# EAGLE design 304_usb_serial020001 (EAGLE 9.6.2)
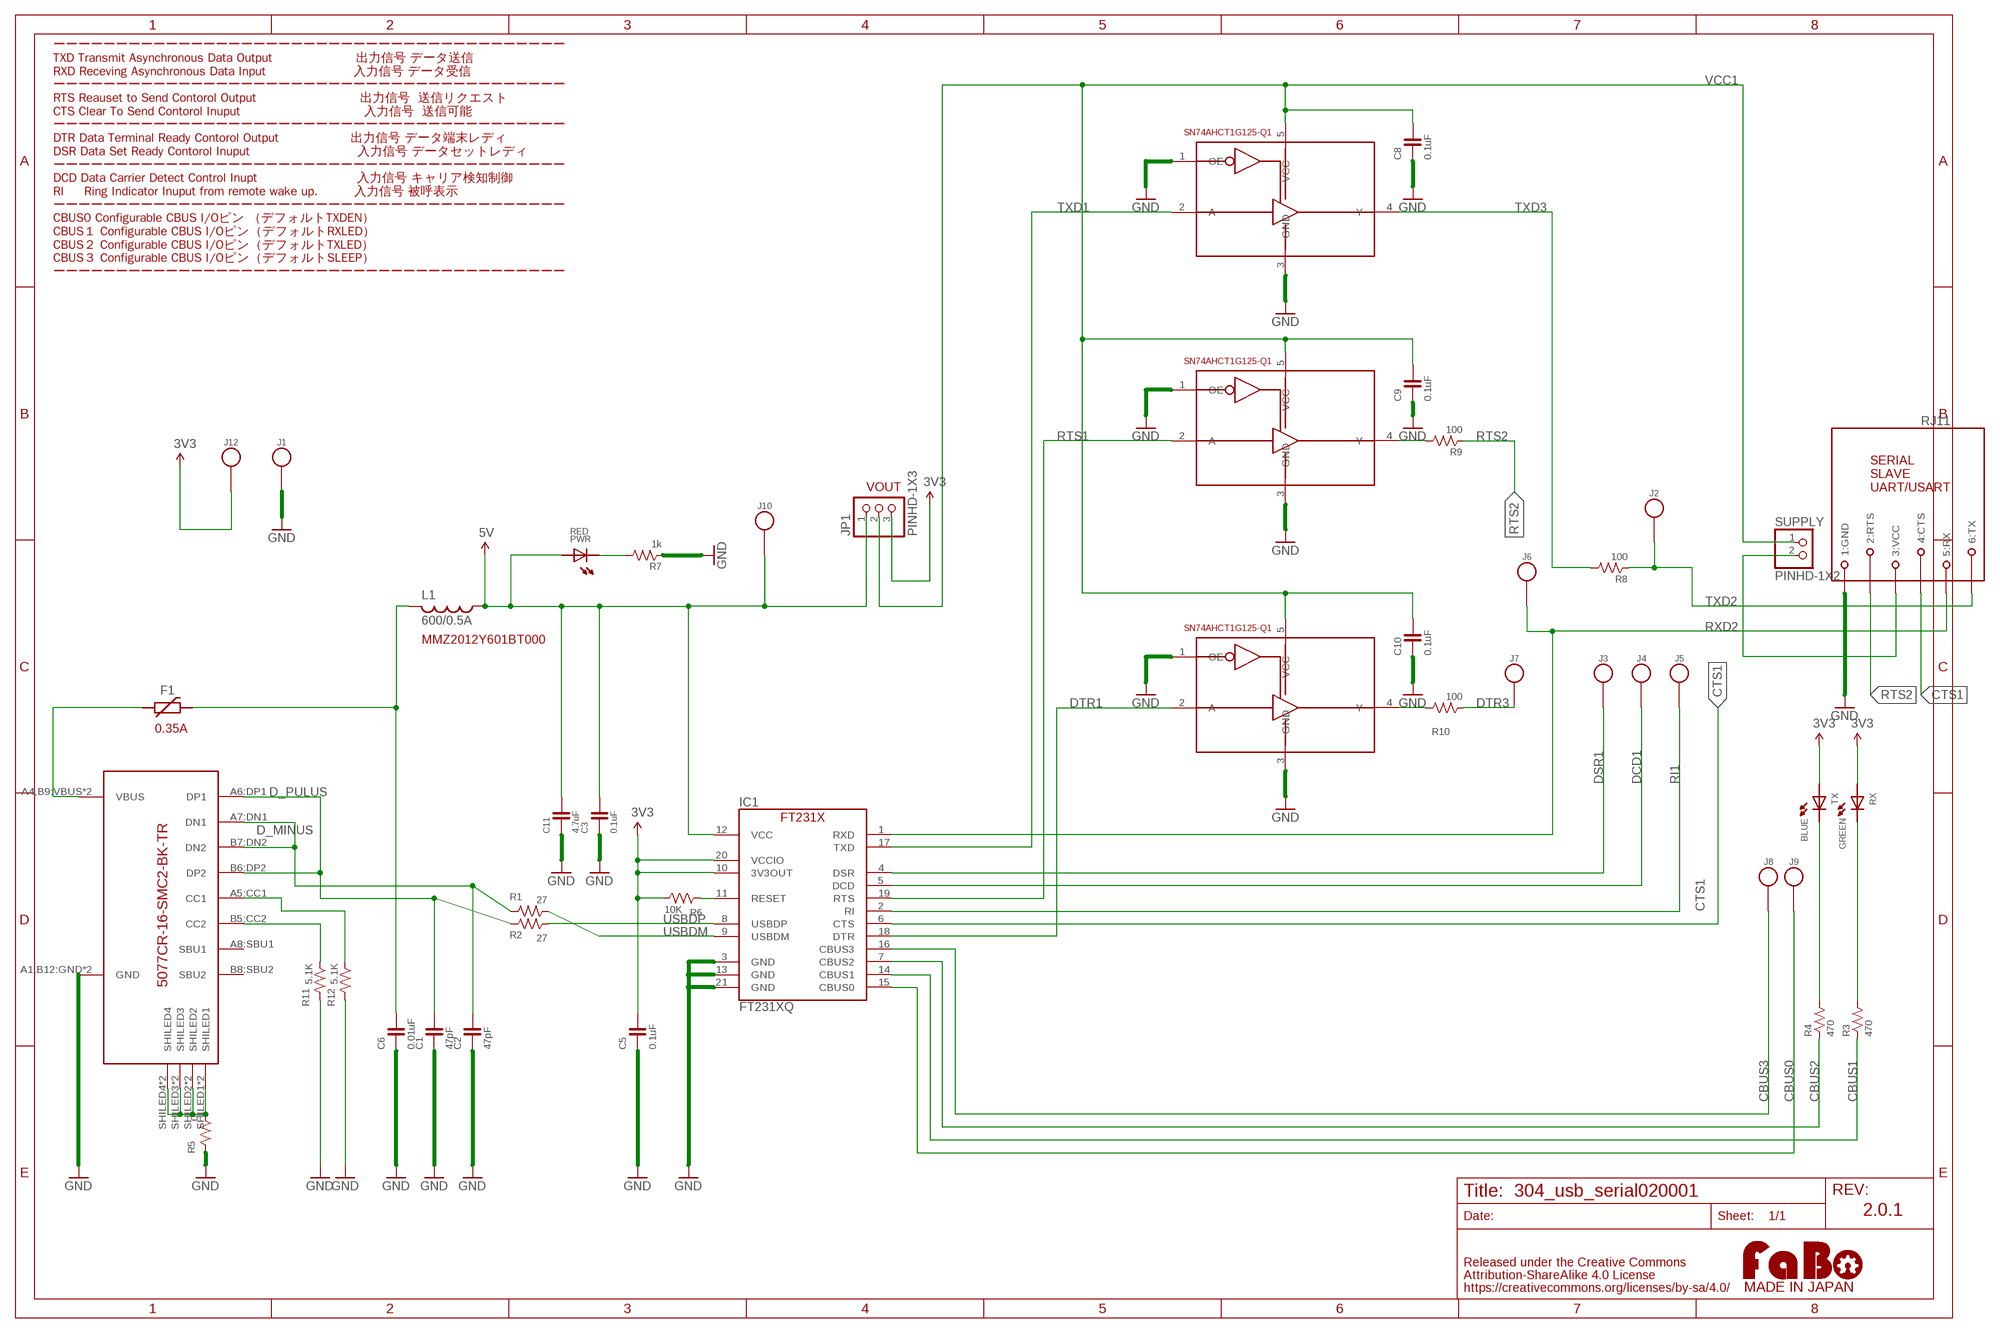
[diagram p0: schematic, sheet 1]

## Parts
C1  47pF  CAPACITOR-0402  [0402]
C2  47pF  CAPACITOR-0402  [0402]
C3  0.1uF  CAPACITOR-0402  [0402]
C5  0.1uF  CAPACITOR-0402  [0402]
C6  0.01uF  CAPACITOR-0402  [0402]
C8  0.1uF  CAPACITOR-0402  [0402]
C9  0.1uF  CAPACITOR-0402  [0402]
C10  0.1uF  CAPACITOR-0402  [0402]
C11  4.7uF  CAPACITOR-0402  [0402]
F1  350mA  POLYSWITCH  [NANOSMDC035F]
IC1  FT231XQ  [QFN-20_FT231X]
J1  PIN_HEADER_1X1_NOLABEL_C  [PIN_1X1_NOLABEL]
J2  PIN_HEADER_1X1_NOLABEL_C  [PIN_1X1_NOLABEL]
J3  PIN_HEADER_1X1_NOLABEL_C  [PIN_1X1_NOLABEL]
J4  PIN_HEADER_1X1_NOLABEL_C  [PIN_1X1_NOLABEL]
J5  PIN_HEADER_1X1_NOLABEL_C  [PIN_1X1_NOLABEL]
J6  PIN_HEADER_1X1_NOLABEL_C  [PIN_1X1_NOLABEL]
J7  PIN_HEADER_1X1_NOLABEL_C  [PIN_1X1_NOLABEL]
J8  PIN_HEADER_1X1_NOLABEL_C  [PIN_1X1_NOLABEL]
J9  PIN_HEADER_1X1_NOLABEL_C  [PIN_1X1_NOLABEL]
J10  PIN_HEADER_1X1_NOLABEL_C  [PIN_1X1_NOLABEL]
J12  PIN_HEADER_1X1_NOLABEL_C  [PIN_1X1_NOLABEL]
JP1  PINHD-1X3  [1X03]
L1  600/0.5A  INDUCTOR_0805_L  [RESC0805_L]
PWR  RED  LED-0603-NARROW  [0603-NARROW]
R1  27  RESISTOR-0603-NARROW  [0603-NARROW]
R2  27  RESISTOR-0603-NARROW  [0603-NARROW]
R3  470  RESISTOR-0603-NARROW  [0603-NARROW]
R4  470  RESISTOR-0603-NARROW  [0603-NARROW]
R5  0  RESISTOR-0603-NARROW  [0603-NARROW]
R6  10K  RESISTOR-0603-NARROW  [0603-NARROW]
R7  1k  RESISTOR-0603-NARROW  [0603-NARROW]
R8  100  RESISTOR-0603-NARROW  [0603-NARROW]
R9  100  RESISTOR-0603-NARROW  [0603-NARROW]
R10  100  RESISTOR-0603-NARROW  [0603-NARROW]
R11  5.1K  RESISTOR-0603-NARROW  [0603-NARROW]
R12  5.1K  RESISTOR-0603-NARROW  [0603-NARROW]
RJ11  MODULAR-JACK-6P-RJ11_SERIAL_S_USART  [7002-6PXC-X]
RX  GREEN  LED-0603-NARROW  [0603-NARROW]
SUPPLY  PINHD-1X2  [1X02]
TX  BLUE  LED-0603-NARROW  [0603-NARROW]
U$2  LOGO_FABO-M_BOTTOM  [LOGO_FABO_MS_BOTTOM]
U$4  5077CR-16-SMC2-BK-TR  [5077CR-16-SMC2-BK-TR]
U$6  SN74AHCT1G125-Q1  [SC70]
U$7  SN74AHCT1G125-Q1  [SC70]
U$8  SN74AHCT1G125-Q1  [SC70]

## Nets
3V3: C5.2 IC1.10(3V3OUT) IC1.20(VCCIO) J12.1 JP1.3 R6.1 RX.ANODE TX.ANODE
5V: C3.2 C11.2 IC1.12(VCC) J10.1 JP1.1 L1.1 PWR.ANODE
CBUS0: IC1.15(CBUS0) J9.1
CBUS1: IC1.14(CBUS1) R3.1
CBUS2: IC1.7(CBUS2) R4.1
CBUS3: IC1.16(CBUS3) J8.1
CTS1: IC1.6(CTS) RJ11.4(4:CTS)
D_MINUS: C2.2 R1.2 U$4.A7:DN1(DN1) U$4.B7:DN2(DN2)
D_PULUS: C1.2 R2.2 U$4.A6:DP1(DP1) U$4.B6:DP2(DP2)
DCD1: IC1.5(DCD) J4.1
DSR1: IC1.4(DSR) J3.1
DTR1: IC1.18(DTR) U$8.2(A)
DTR3: J7.1 R10.1
GND: C1.1 C2.1 C3.1 C5.1 C6.1 C8.1 C9.1 C10.1 C11.1 IC1.3(GND) IC1.13(GND) IC1.21(GND) J1.1 R5.2 R7.1 R11.2 R12.2 RJ11.1(1:GND) U$4.A1,B12:GND(GND) U$4.B1,A12:GND(GND) U$6.1(OE) U$6.3(GND) U$7.1(OE) U$7.3(GND) U$8.1(OE) U$8.3(GND)
N$1: R9.2 U$7.4(Y)
N$2: C6.2 F1.2 L1.2
N$3: R11.1 U$4.B5:CC2(CC2)
N$4: R12.1 U$4.A5:CC1(CC1)
N$5: PWR.CATHODE R7.2
N$8: R10.2 U$8.4(Y)
N$15: IC1.11(RESET) R6.2
N$33: R3.2 RX.CATHODE
N$35: R4.2 TX.CATHODE
RI1: IC1.2(RI) J5.1
RTS1: IC1.19(RTS) U$7.2(A)
RTS2: R9.1 RJ11.2(2:RTS)
RXD2: IC1.1(RXD) J6.1 RJ11.5(5:RX)
SHILED: R5.1 U$4.SHILED1 U$4.SHILED2 U$4.SHILED3 U$4.SHILED4 U$4.SHILED5(SHILED1) U$4.SHILED6(SHILED2) U$4.SHILED7(SHILED3) U$4.SHILED8(SHILED4)
TXD1: IC1.17(TXD) U$6.2(A)
TXD2: J2.1 R8.1 RJ11.6(6:TX)
TXD3: R8.2 U$6.4(Y)
USBDM: IC1.9(USBDM) R1.1
USBDP: IC1.8(USBDP) R2.1
VBUS: F1.1 U$4.A4,B9:VBUS(VBUS) U$4.B4,A9:VBUS(VBUS)
VCC1: C8.2 C9.2 C10.2 JP1.2 SUPPLY.1 U$6.5(VCC) U$7.5(VCC) U$8.5(VCC)
VCC2: RJ11.3(3:VCC) SUPPLY.2
Unconnected: U$4.A8:SBU1(SBU1) U$4.B8:SBU2(SBU2)

## Notes on the sheet
- ーーーーーーーーーーーーーーーーーーーーーーーーーーーーーーーーーーーーーーーーー
  TXD Transmit Asynchronous Data Output                     出力信号 データ送信
  RXD Receving Asynchronous Data Input                      入力信号 データ受信
  ーーーーーーーーーーーーーーーーーーーーーーーーーーーーーーーーーーーーーーーーー
  RTS Reauset to Send Contorol Output                          出力信号  送信リクエスト
  CTS Clear To Send Contorol Inuput                               入力信号  送信可能 
  ーーーーーーーーーーーーーーーーーーーーーーーーーーーーーーーーーーーーーーーーー
  DTR Data Terminal Ready Contorol Output                  出力信号 データ端末レディ
  DSR Data Set Ready Contorol Inuput                           入力信号 データセットレディ
  ーーーーーーーーーーーーーーーーーーーーーーーーーーーーーーーーーーーーーーーーー
  DCD Data Carrier Detect Control Inupt                         入力信号 キャリア検知制御
  RI     Ring Indicator Inuput from remote wake up.         入力信号 被呼表示
  ーーーーーーーーーーーーーーーーーーーーーーーーーーーーーーーーーーーーーーーーー
  CBUS0 Configurable CBUS I/Oピン （デフォルトTXDEN）
  CBUS１ Configurable CBUS I/Oピン（デフォルトRXLED）
  CBUS２ Configurable CBUS I/Oピン（デフォルトTXLED）
  CBUS３ Configurable CBUS I/Oピン（デフォルトSLEEP）
  ーーーーーーーーーーーーーーーーーーーーーーーーーーーーーーーーーーーーーーーーー
- VOUT
- MMZ2012Y601BT000
- 0.35A
- 2.0.1

## Library data of the parts
C1-C3 C5 C6 C8-C11 = FaBo-Capacitor:CAPACITOR: CAPACITOR
F1 = FaBo-Parts:POLYSWITCH
IC1 = FaBo-USB:FT231X
J1-J10 J12 = FaBo-PIN:PIN_HEADER_1X1_NOLABEL_C
JP1 = Connector:PINHD-1X3: PIN HEADER; CATEGORY: CONNECTOR; SUB-CATEGORY: PIN-HEADER
L1 = Nordic_nRF:INDUCTOR: Generic chip inductor
PWR RX TX = FaBo-LED:LED
R1-R12 = FaBo-Resistors:RESISTOR: RESISTOR
RJ11 = FaBo-Connetor:MODULAR-JACK-6P-RJ11_SERIAL_S_USART
SUPPLY = Connector:PINHD-1X2: PIN HEADER; CATEGORY: CONNECTOR; SUB-CATEGORY: PIN-HEADER
U$2 = FaBo-Logo:LOGO_FABO
U$4 = FaBo-USB:5077CR-16-SMC2-BK-TR
U$6-U$8 = FaBo-LevelTranslator:SN74AHCT1G125-Q1: SN74AHCT1G125-Q1 SINGLE BUFFER GATE WITH 3 STATE OUTPUT

## Board
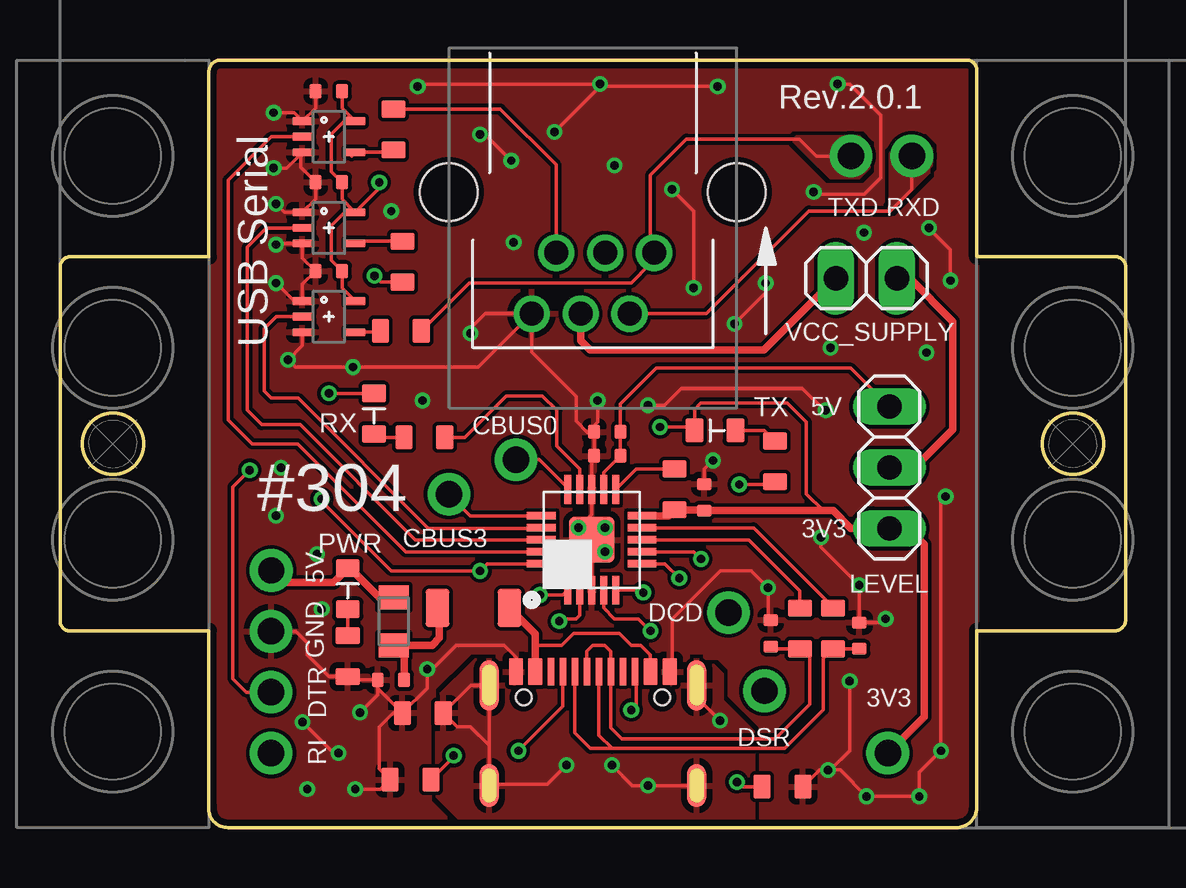
[diagram p1: board, top side]
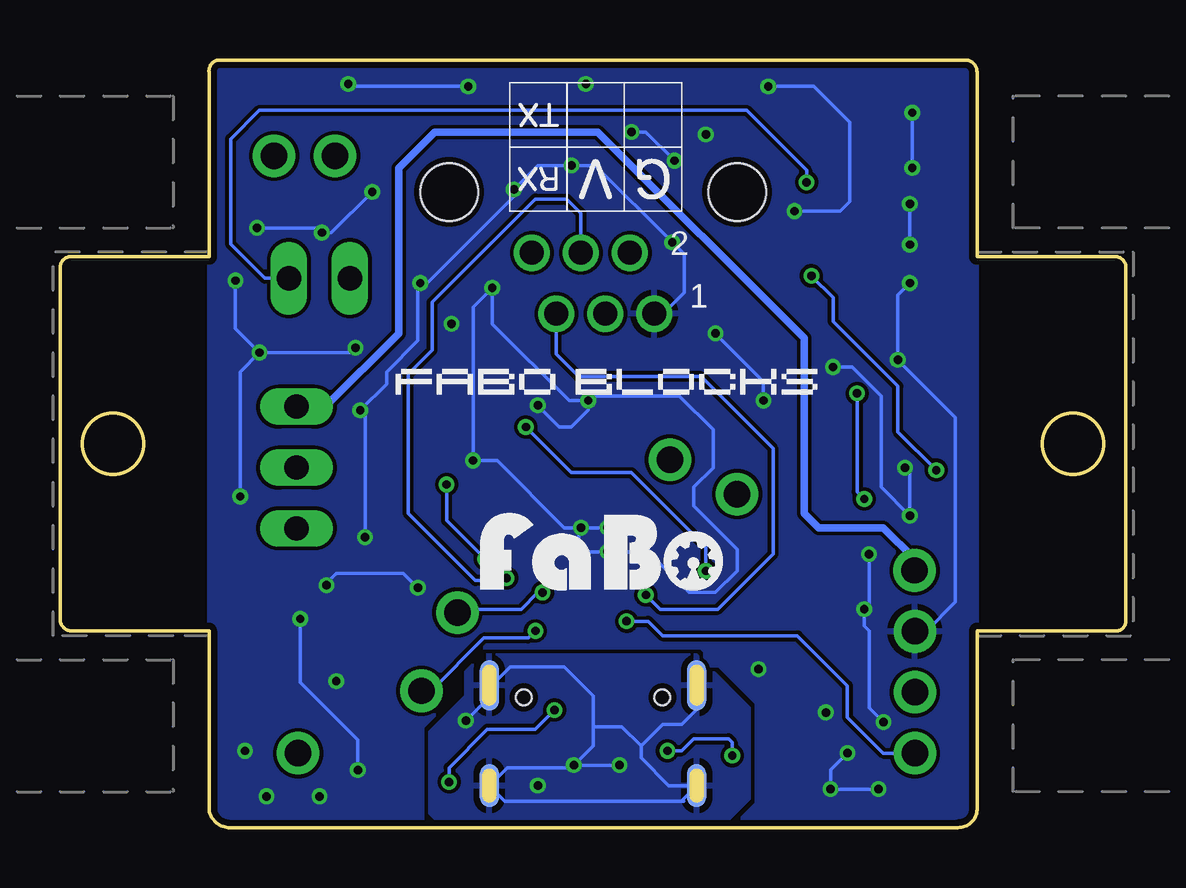
[diagram p2: board, bottom side, seen from below]

Size 44.41 x 32 mm. Coordinates in mm from the lower left corner, seen from the top.
Outline: 6.7,32 37.8,32 arc-90 38.2,31.5 38.2,23.8 44,23.8 arc-90 44.4,23.3 44.4,8.8 arc-90 44,8.2 38.2,8.2 38.2,0.9 arc-90 37.4,0 7,0 arc-99 6.2,0.9 6.2,8.2 0.4,8.2 arc-90 0,8.6 0,23.3 arc-90 0.4,23.8 6.2,23.8 6.2,31.5 arc-90 6.7,32
Outline: circle at 42.2,16 radius 1.27
Outline: circle at 2.2,16 radius 1.27
Copper layers (1*16): Top 0.035mm / dielectric 1.5mm / Bottom 0.035mm
Design rules "Elecrow_angle": minimum track width 6mil, minimum drill 12mil, track to track 6mil, track to pad 6mil, pad to pad 6mil, via to via 6mil, smd to smd 0mil, copper to edge 10mil, drill to drill 10mil, minimum pad ring 10mil, minimum via ring 6mil, stop-mask expansion 2mil, vias tented up to drill 100mil, thermal gap 10mil
tRestrict: area -1.5,7.8 to 6.2,27.4; area 38.3,7.7 to 46,27.3
bRestrict: area -1.6,7.8 to 6.1,27.4; area 38.3,7.7 to 46,27.3

### Footprints (pad centres in the part's own frame; a part is rotated, then mirrored left to right if it is on the bottom)
0402 = smd 0.5 x 0.6: 1 -0.55,0; 2 0.55,0
NANOSMDC035F = smd 1 x 1.6: 1 -1.5,0; 2 1.5,0
QFN-20_FT231X = smd 1.2 x 0.3: 1 -2.1,1; 2 -2.1,0.5; 3 -2.1,0; 4 -2.1,-0.5; 5 -2.1,-1; 11 2.1,-1; 12 2.1,-0.5; 13 2.1,0; 14 2.1,0.5; 15 2.1,1 | smd 0.3 x 1.2: 6 -1,-2.1; 7 -0.5,-2.1; 8 0,-2.1; 9 0.5,-2.1; 10 1,-2.1; 16 1,2.1; 17 0.5,2.1; 18 0,2.1; 19 -0.5,2.1; 20 -1,2.1 | smd 1.9 x 1.9: 21 0,0
PIN_1X1_NOLABEL = drill 1.1 pad 1.778: 1 0,0
1X03 = drill 1.016 long: 1 -2.54,0; 2 0,0; 3 2.54,0
RESC0805_L = smd 1 x 1.25: 1 -1,0; 2 1,0
0603-NARROW = smd 0.75 x 1: ANODE -0.85,0; CATHODE 0.85,0
0603-NARROW' = smd 0.71 x 1: 1 -0.85,0; 2 0.85,0
7002-6PXC-X = drill 1: 1 2.55,5.08; 2 1.53,2.54; 3 0.51,5.08; 4 -0.51,2.54; 5 -1.53,5.08; 6 -2.55,2.54 | hole 2.4: -6,0; 6,0
1X02 = drill 1.016 long: 1 -1.27,0; 2 1.27,0
5077CR-16-SMC2-BK-TR = smd 0.6 x 1.14: A1,B12:GND -3.2,0; A4,B9:VBUS -2.4,0; B1,A12:GND 3.2,0; B4,A9:VBUS 2.4,0 | smd 0.3 x 1.14: A5:CC1 -1.25,0; A6:DP1 -0.25,0; A7:DN1 0.25,0; A8:SBU1 1.25,0; B5:CC2 1.75,0; B6:DP2 0.75,0; B7:DN2 -0.75,0; B8:SBU2 -1.75,0 | smd 0.8 x 2.1: SHILED1 -4.32,-0.57; SHILED2 4.32,-0.57 | smd 0.8 x 1.8: SHILED3 -4.32,-4.75; SHILED4 4.32,-4.75 | smd 0.8 x 2.1 bottom: SHILED5 -4.32,-0.57; SHILED7 4.32,-0.57 | smd 0.8 x 1.8 bottom: SHILED6 -4.32,-4.75; SHILED8 4.32,-4.75 | hole 0.65: -2.89,-1.07; 2.89,-1.07
SC70 = smd 0.35 x 0.85: 1 -0.65,-1.1; 2 0,-1.1; 3 0.65,-1.1; 4 0.65,1.1; 5 -0.65,1.1

### Placement (x,y rotation side)
C1  29.61,8.1 270 top
C2  33.31,8 270 top
C3  22.8,15.5 0 top
C5  26.84,13.77 270 top
C6  13.79,6.15 0 top
C8  11.2,30.7 0 top
C9  11.2,26.9 0 top
C10  11.2,23.2 0 top
C11  22.8,16.5 0 top
F1  17.23,9.15 180 top
IC1  22.15,12 90 top
J1  8.79,8.18 180 top
J2  32.95,28 180 top
J3  29.35,5.7 180 top
J4  27.85,8.96 180 top
J5  8.79,3.1 180 top
J6  35.49,28 180 top
J7  8.79,5.64 180 top
J8  16.2,13.9 180 top
J9  19,15.34 180 top
J10  8.8,10.72 180 top
J12  34.49,3.1 180 top
JP1  34.56,15.01 270 top
L1  13.9,8.6 270 top
PWR  11.99,9.96 270 top
R1  27  [0603-NARROW']  32.2,8.3 270 top
R2  27  [0603-NARROW']  30.83,8.3 270 top
R3  470  [0603-NARROW']  15.18,16.27 180 top
R4  470  [0603-NARROW']  29.79,15.27 90 top
R5  0  [0603-NARROW']  15.12,4.78 180 top
R6  10K  [0603-NARROW']  25.6,14.1 90 top
R7  1k  [0603-NARROW']  11.99,7.14 90 top
R8  100  [0603-NARROW']  14.2,20.7 180 top
R9  100  [0603-NARROW']  13.9,29.1 270 top
R10  100  [0603-NARROW']  14.27,23.59 90 top
R11  5.1K  [0603-NARROW']  30.1,1.7 0 top
R12  5.1K  [0603-NARROW']  14.6,2 180 top
RJ11  22.2,26.5 180 top
RX  13.08,17.25 270 top
SUPPLY  33.6,22.9 180 top
TX  27.29,16.55 0 top
U$2  21.83,9.5 0 top
U$3  [4-1BLOCK]  2.2,16 0 top
U$4  22.2,6.5 0 top
U$5  [4-1BLOCK]  42.2,16 180 top
U$6  11.2,21.3 270 top
U$7  11.2,28.8 270 top
U$8  11.2,25 270 top

### Tracks (layer width: path | path; a pad name or v marks a point on that pad's centre or on a via)
3V3  (via drill 0.35)
  Top 0.152: 25.58,13.22 25.35,13 | IC1.20 17.8,11 v17.5,10.7 13.8,10.7 10.9,13.6 v10.9,13.7 | RX.ANODE v11.2,18.1 | v25,16.7 26.29,16.7 TX.ANODE 26.44,17.43 26.7,17.7 30.3,17.7 31.1,16.9 31.1,13.91 31.8,13.21
  Top 0.305: IC1.10 25.35,13 | 25.58,13.22 R6.1 26.81,13.25 C5.2 31.8,13.21 32.21,13.21 32.96,12.47 JP1.3 35.33,12.47 36,11.8 36,4.61 J12.1
  Bottom 0.152: v25,16.7 23.1,14.8 20.6,14.8 17.5,11.7 v17.5,10.7 | v10.9,13.7 11.2,14 v11.2,18.1
5V
  Top 0.152: IC1.12 22.65,14.8 C3.2 C11.2 23.35,17.65 24.85,19.15 32.96,19.15 JP1.1 | L1.1 13.7,9.8
  Top 0.305: J10.1 9.3,10.22 11.4,10.22 PWR.ANODE 12.1,10.8 13.3,9.6 L1.1
  Bottom 0.152: 34.35,17.55 JP1.1
  Bottom 0.305: JP1.1 33.35,17.55 30.3,20.6 30.3,27.5 28.8,29 22,29 13.4,20.4 13.4,13.1 12.8,12.5 10.1,12.5 8.8,11.2 J10.1
CBUS0
  Top 0.152: J9.1 19.96,15.34 21.15,14.15 IC1.15
CBUS1
  Top 0.152: IC1.14 21.65,14.95 20.7,15.9 20.7,17.4 20.1,18 18.6,18 16.87,16.27 R3.1
CBUS2  (via drill 0.35)
  Top 0.152: IC1.7 26.4,11.5 v26.7,11.2 | R4.1 29.67,14.3 v28.3,14.3
  Bottom 0.152: v26.7,11.2 28.3,12.8 v28.3,14.3
CBUS3
  Top 0.152: IC1.16 17.1,13 J8.1
CTS1  (via drill 0.35)
  Top 0.152: IC1.6 25.2,11 v25.8,10.4
  Bottom 0.152: v25.8,10.4 25.9,10.3 27.1,10.3 29.9,13.1 29.9,18.9 28.9,19.9 28.9,21.9 24.6,26.2 23.3,26.2 22.71,25.61 RJ11.4
D_MINUS
  Top 0.152: C2.2 R1.2 31.8,7.05 31.8,4.9 30.2,3.3 23,3.3 | 23,3.3 22.1,3.3 21.45,3.95 U$4.B7:DN2 | U$4.A7:DN1 22.45,3.85 23,3.3
D_PULUS
  Top 0.152: C1.2 29.71,7.45 R2.2 30.93,7.45 31.23,7.15 31.23,5.13 29.8,3.7 23.4,3.7 22.95,4.15 U$4.B6:DP2 22.95,7.35 22.7,7.6 22.2,7.6 21.95,7.35 U$4.A6:DP1
DCD1  (via drill 0.35)
  Top 0.152: IC1.5 24.2,9.9 v24.3,9.8
  Bottom 0.152: J4.1 27.71,9.1 25.2,9.1 24.5,9.8 v24.3,9.8
DSR1  (via drill 0.35)
  Top 0.152: v24.6,8.2 24.1,8.7 23.1,8.7 22.65,9.15 IC1.4
  Bottom 0.152: J3.1 28.95,5.7 26.75,7.9 24.9,7.9 v24.6,8.2
DTR1
  Top 0.152: IC1.18 14.8,12 10,16.8 8.4,16.8 7.8,17.4 7.8,24.2 8.6,25 U$8.2
DTR3  (via drill 0.35)
  Top 0.152: 14.31,22.7 R10.1 13.36,22.74 v13.1,23 | v7.9,14.9 7.2,14.2 7.2,6.2 7.76,5.64 J7.1
  Bottom 0.152: v7.9,14.9 9.5,16.5 9.5,18.4 12.2,21.1 12.2,22.1 v13.1,23
GND  (via drill 0.35)
  Top 0.152: v22.7,11.5 22.55,11.35 22.55,11.6 22.43,11.72 | R5.2 13.24,5.8 C6.1 | C6.1 12.13,6.15 R7.1 | R7.1 11.99,6.51 | U$4.A1,B12:GND 19,7.1 18.5,7.6 16.5,7.6 15.5,6.6 v15.3,6.6 15.3,5.81 R5.2 | U$7.3 10.03,28.07 | 10.03,28.07 9.45,27.5 v8.9,27.5 | v8.9,29.8 9.75,29.8 U$7.1 10.65,30 C8.1 | v9,26 9.35,25.65 U$8.1 10.65,26.2 C9.1 10.03,27.52 10.03,28.07 | v9,24.3 9.05,24.35 U$8.3 10.1,23.75 C10.1 10.1,22.65 U$6.1 9.75,21.95 v9,22.7 | U$6.3 10.1,20.1 v9.5,19.5 9.8,19.2 v12.2,19.2 17.43,19.2 RJ11.1 | 22.13,16.62 C11.1 C3.1 22.15,15.4 IC1.13 22.15,13.05 v21.6,12.5 22.1,12 IC1.21 22.43,11.72 | RJ11.1 19.65,19.82 21.5,17.97 21.5,16.95 21.98,16.48 22.13,16.62 | 22.65,12.5 v22.7,12.5 | v34.4,8.7 34.25,8.55 C2.1 v33.31,10.1 v33.3,10.1 31.7,11.7 v31.7,12.1 | C1.1 29.5,8.76 v29.5,10 28.8,10.7 27.5,10.7 25.5,8.7 25.5,6.6 U$4.B1,A12:GND | v26.4,22.5 26.4,25.7 v25.5,26.6 | C5.1 26.84,14.94 v27.2,15.3 | IC1.3 22.15,11.45 22.43,11.72 | R5.2 13.88,4.78 13.3,4.2 13.3,2.45 R12.2 13.35,1.6 v12.3,1.6 | v22.4,17.8 22.4,16.9 22.13,16.62 | v31.9,17.4 31.83,17.4 30.93,18.3 25.88,18.3 25.17,17.6 v24.5,17.6 | R11.2 31.65,2.4 v32,2.4 32.1,2.4 | R7.1 11.21,6.29 10.3,7.2 10.3,7.7 9.82,8.18 J1.1 | 32.1,2.4 32.5,2.4 v33.6,1.3 v35.8,1.3 35.8,2.3 v36.7,3.2 36.7,13.6 v36.9,13.8 | v32.9,6.1 32.9,3.2 32.1,2.4 | v32.4,31 32.9,31 34.2,29.7 34.2,27.1 33.5,26.4 31.5,26.4 v31.4,26.5 | v27.4,30.9 22.6,30.9 v22.5,31 22.4,31 | 22.4,31 15,31 v14.9,30.9 | RJ11.1 17.72,21.42 17.1,20.8 v17.1,20.6 | v37.1,22.8 37.1,24.1 v36.2,25 | v18.8,27.8 17.7,28.9 v17.5,28.9 | v20.6,29 22.4,30.8 22.4,31 | v12.5,4.8 13.24,5.54 C6.1 | v11.6,3.1 11.4,3.1 v10.1,4.4
  Top 0.152: v28.1,21 29.4,22.3 v29.4,22.7
  Bottom 0.152: v8.9,27.5 v8.9,29.8 | v9,26 v9,24.3 | v9,22.7 9.5,22.2 v9.5,19.5 7.1,17.1 7.1,9.4 8.32,8.18 J1.1 | v34.4,8.7 34.4,6.05 32,3.65 v32,2.4 | v29.5,10 30.1,10.6 32.9,10.6 33.3,10.2 v33.3,10.1 | RJ11.1 19.28,21.42 18.4,22.3 18.4,23.9 v18.9,24.4 22.1,27.6 v23.1,27.6 24.5,27.6 v25.5,26.6 25.5,26.3 29.1,22.7 v29.4,22.7 29.5,22.6 29.5,20.3 30.8,19 30.8,18.5 v31.9,17.4 31.7,17.2 v31.7,12.1 | 22.8,12.5 23.4,12.5 26.2,15.3 v27.2,15.3 27.2,21.7 v26.4,22.5 26.4,21 23.2,17.8 v22.4,17.8 | 22.8,12.5 v22.7,12.5 v21.6,12.5 v21.6,11.5 | v21.6,11.5 v22.7,11.5 22.8,11.6 22.8,12.5 | v21.6,11.5 19.9,11.5 18.2,9.8 17.1,9.8 16.2,10.7 16.2,11.6 18,13.4 18,14.2 17.2,15 17.2,16.6 18.6,18 22.2,18 v22.4,17.8 | v24.5,17.6 23.6,16.7 23.1,16.7 22.4,17.4 v22.4,17.8 | v36.9,13.8 36.9,19 v36.1,19.8 | v36.1,19.8 32.3,19.8 v32.1,20 | v36.1,19.8 37.1,20.8 v37.1,22.8 | v36.2,25 33.7,25 v33.5,24.8 33.1,24.8 v31.4,26.5 | v27.4,30.9 32.3,30.9 v32.4,31 | v15.1,17.8 15.1,18.6 v17.1,20.6 | v12.2,19.2 11.4,19.2 10.2,18 10.2,14.2 v9,13 9,14.8 v9.2,15 | v18.8,27.8 20,29 v20.6,29 | v10.3,1.6 v12.3,1.6 12.3,2.4 v11.6,3.1 | v10.7,11.4 10.7,9.3 v10.9,9.1 10.9,8.4 10.7,8.2 10.7,5 v10.1,4.4 | v13.8,25.7 11.9,25.7 11.5,26.1 11.5,29.4 13,30.9 v14.9,30.9
  pour Bottom (rank 6): 47.9,33 -2.64,33 -2.64,-2 47.9,-2
  pour Top (rank 6): 47.1,33.3 -2.84,33.3 -2.84,-1.8 47.1,-1.8
N$1
  Top 0.152: 12.15,28 U$7.4 13.8,28.15 R9.2
N$2
  Top 0.152: C6.2 14.4,6.21 | L1.2 14.1,7.6 14.2,7.5
  Top 0.305: C6.2 14.34,7.37 14.2,7.5 | 14.37,7.6 L1.2 15.5,7.6 15.8,7.9 15.8,9.08 F1.2
N$3  (via drill 0.35)
  Top 0.152: U$4.B5:CC2 24,6.45 24,5.1 v23.8,4.9 | v28.2,1.9 28.4,1.7 R11.1
  Bottom 0.152: v23.8,4.9 24.6,4.1 26.6,4.1 28.2,2.5 v28.2,1.9
N$4  (via drill 0.35)
  Top 0.152: U$4.A5:CC1 20.95,5.05 v19.1,3.2 | v16.4,3 16.4,2.95 R12.1
  Bottom 0.152: v19.1,3.2 18.5,3.2 18,3.7 16.55,3.7 16.4,3.55 v16.4,3
N$5
  Top 0.152: R7.2 PWR.CATHODE
N$8
  Top 0.152: U$8.4 12.39,24.44 R10.2
N$15
  Top 0.152: R6.2 24,14.95 IC1.11
N$33
  Top 0.152: R3.2 13.22,16.27 RX.CATHODE
N$35
  Top 0.152: R4.2 29.35,16.55 TX.CATHODE
RI1  (via drill 0.35)
  Top 0.152: IC1.2 21.65,8.85 21.5,8.7 20.9,8.7 v20.8,8.6
  Bottom 0.152: v20.8,8.6 19.9,8.6 19.3,8 13.69,8 11.6,5.91 11.6,4.6 10.1,3.1 J5.1
RTS1
  Top 0.152: IC1.19 14.4,11.5 9.9,16 8,16 7,17 7,27 8.8,28.8 U$7.2
RTS2
  Top 0.152: RJ11.2 20.67,27.63 18.35,29.95 R9.1
RXD2  (via drill 0.35)
  Top 0.152: IC1.1 20.95,9.7 v20,9.7 | RJ11.5 26.92,21.42 31.2,25.7 34.6,25.7 35.49,26.59 J6.1
  Bottom 0.152: v20,9.7 19.4,9.1 17,9.1 14.7,11.4 14.7,15.8 17.7,18.8 22.8,18.8 23.73,19.73 RJ11.5
  pour Top (no thermals): 34.5,25.8 34.6,25.9 34.6,28.1 35.2,28.7 35.5,28.7 35.9,28.7 36.3,28.3 36.3,27.6 36.2,27.5 36.2,27.3 34.6,25.7
SHILED  (via drill 0.35)
  Top 0.152: U$4.SHILED4 v24.5,1.75 23.85,1.75 v23,2.6 | U$4.SHILED2 26.52,5.44 v27.5,4.46 | U$4.SHILED6 17.88,1.8 20.3,1.8 v21.1,2.6 | U$4.SHILED6 17.88,5.9 | 17.88,5.9 U$4.SHILED5 | 17.88,5.9 17.85,5.93 17.12,5.93 R5.1 16.54,4.2 17.1,4.2 17.88,3.42 U$4.SHILED6
  Bottom 0.152: U$4.SHILED2 26.38,6.08 26.38,5.97 | 26.38,5.97 25.65,6.7 23.4,6.7 22.2,5.5 22.2,4.2 | 22.2,4.2 22.2,3.4 22.95,2.65 | 22.95,2.65 v23,2.6 23.1,2.5 25.77,2.5 U$4.SHILED4 25.87,1.1 18.43,1.1 | 20.2,3.4 19.3,4.3 18.5,4.3 17.88,4.92 U$4.SHILED5 | 20.2,3.4 20.2,2.9 19.05,1.75 U$4.SHILED6 18.53,1.1 | v27.5,4.46 26.38,5.58 26.38,5.97 | v21.1,2.6 22.9,2.6 22.95,2.65 | 20.2,3.4 21,4.2 22.2,4.2
  pour Top: 15.7,1.3 15.7,5.4 17.3,7 27,7 27.6,6.4 27.6,5.3 28.9,4 28.9,0.3 27.8,-0.8 17.8,-0.8
  pour Bottom: 15.7,1.2 15.7,5 17.9,7.2 26.8,7.2 27.5,6.5 27.5,5.5 29,4 29,0.6 27.5,-0.9 17.8,-0.9
TXD1
  Top 0.152: IC1.17 20.03,12.48 15.34,12.48 9.92,17.9 8.8,17.9 8.5,18.2 8.5,20.8 9,21.3 U$6.2
TXD2
  Top 0.152: R8.1 17.05,22.7 23.79,22.7 24.6,23.5 24.6,23.8 | 24.6,23.8 RJ11.6 | 24.6,23.8 24.6,27.2 26.1,28.7 30.8,28.7 31.5,28 J2.1
  pour Top (no thermals): 32.8,27.1 32.1,27.1 30.6,28.6 30.6,28.7 30.7,28.8 33,28.8 33.3,28.8 33.6,28.5 33.7,28.4 33.7,27.5 33.3,27.1
TXD3
  Top 0.152: 12.25,20.6 U$6.4 13.3,20.65 R8.2
USBDM
  Top 0.152: IC1.9 28.9,12.5 32.2,9.2 R1.1
USBDP
  Top 0.152: R2.1 30.83,9.87 28.7,12 IC1.8
VBUS
  Top 0.152: U$4.B4,A9:VBUS 24.6,7.2 24.2,7.6 23.8,7.6 23.3,8.1 21.4,8.1 20.9,7.6 19.8,7.6
  Top 0.305: U$4.A4,B9:VBUS 19.8,7.6 19.8,8.08 F1.1
VCC1  (via drill 0.35)
  Top 0.152: U$6.5 11.75,22.5 C10.2 11.3,23.65 11.3,25.1 11.93,25.73 12.23,25.73 | U$7.5 12.08,29.68 | 12.08,29.68 11.75,30 C8.2 | 12.08,29.68 11.3,28.9 11.3,27.35 C9.2 11.75,26.2 12.23,25.73 | 12.23,25.73 U$8.5 13.3,26.65 v13.3,26.9
  Top 0.305: JP1.2 35.61,15.01 37.2,16.6 37.2,21.1 35.4,22.9 SUPPLY.1
  Bottom 0.152: SUPPLY.1 35.87,22.9 37.3,24.33 37.3,28.7 36.1,29.9 15.8,29.9 13.3,27.4 v13.3,26.9
VCC2
  Top 0.305: SUPPLY.2 29.33,19.9 22.1,19.9 21.69,20.31 RJ11.3

### Text on the board
tPlace: Rev.2.0.1 | USB Serial | TXD | RXD | VCC_SUPPLY | 5V | CBUS0 | #304 | 3V3 | CBUS3 | 5V | LEVEL | DCD | GND | DTR | 3V3 | DSR | RI
bPlace: 2 | 1
tDocu: #304 USB Serial FaBo BLOCKS Rev2.0.1 / 2023/01/12